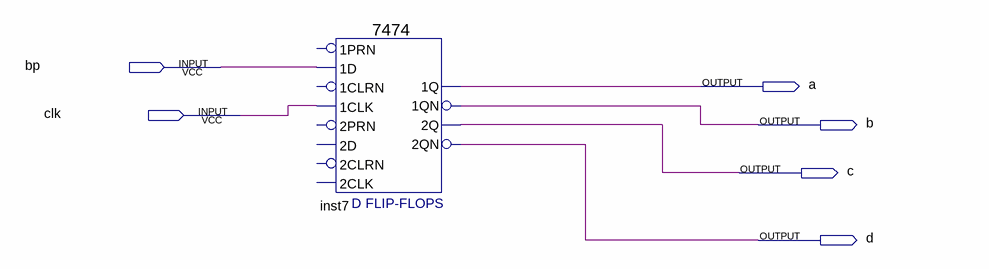
[diagram p0: schematic sheet]
// Quartus schematic adder.bdf as structural Verilog: 1 symbols, 6 pins
module adder (
  input  bp,
  input  clk,
  output a,
  output b,
  output c,
  output d
);

  \7474  inst7 (
    .\1CLK (clk), .\1D (bp), .\1QN (b), .\2Q (c), .\2QN (d), .\1Q (a));  // open: 2D, 2PRN, 1PRN, 2CLK, 2CLRN, 1CLRN
endmodule
